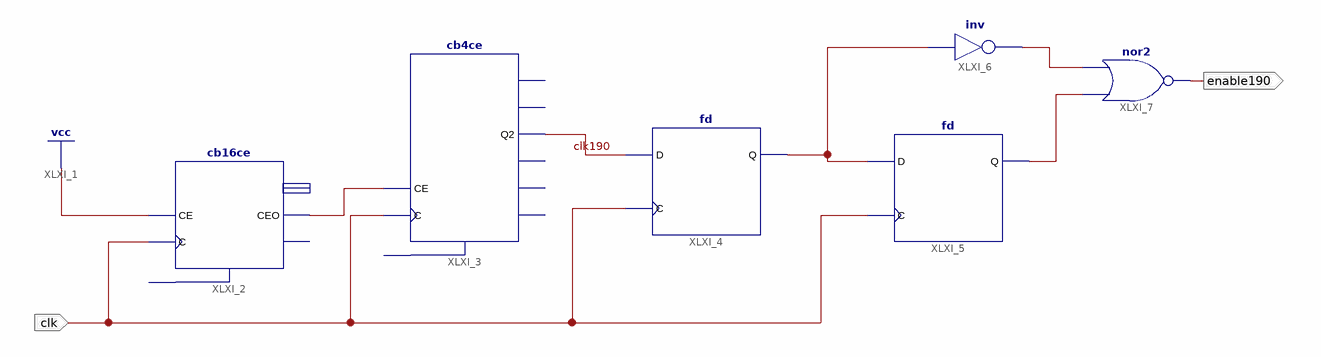
[diagram p0: schematic sheet 1]
// Xilinx ISE schematic enable190.sch (spartan6) as structural Verilog: 6 symbols, 2 ports
module enable190 (
  input  clk,
  output enable190
);

  wire clk190, XLXN_3, XLXN_7, XLXN_8, XLXN_9;

  cb16ce XLXI_2 (.C(clk), .CE(1'b1), .CEO(XLXN_3));  // open: CLR, Q, TC
  cb4ce XLXI_3 (.C(clk), .CE(XLXN_3), .Q2(clk190));  // open: CLR, CEO, Q0, Q1, Q3, TC
  fd XLXI_4 (.C(clk), .D(clk190), .Q(XLXN_7));
  fd XLXI_5 (.C(clk), .D(XLXN_7), .Q(XLXN_9));
  not XLXI_6 (XLXN_8, XLXN_7);
  nor XLXI_7 (enable190, XLXN_9, XLXN_8);
endmodule
